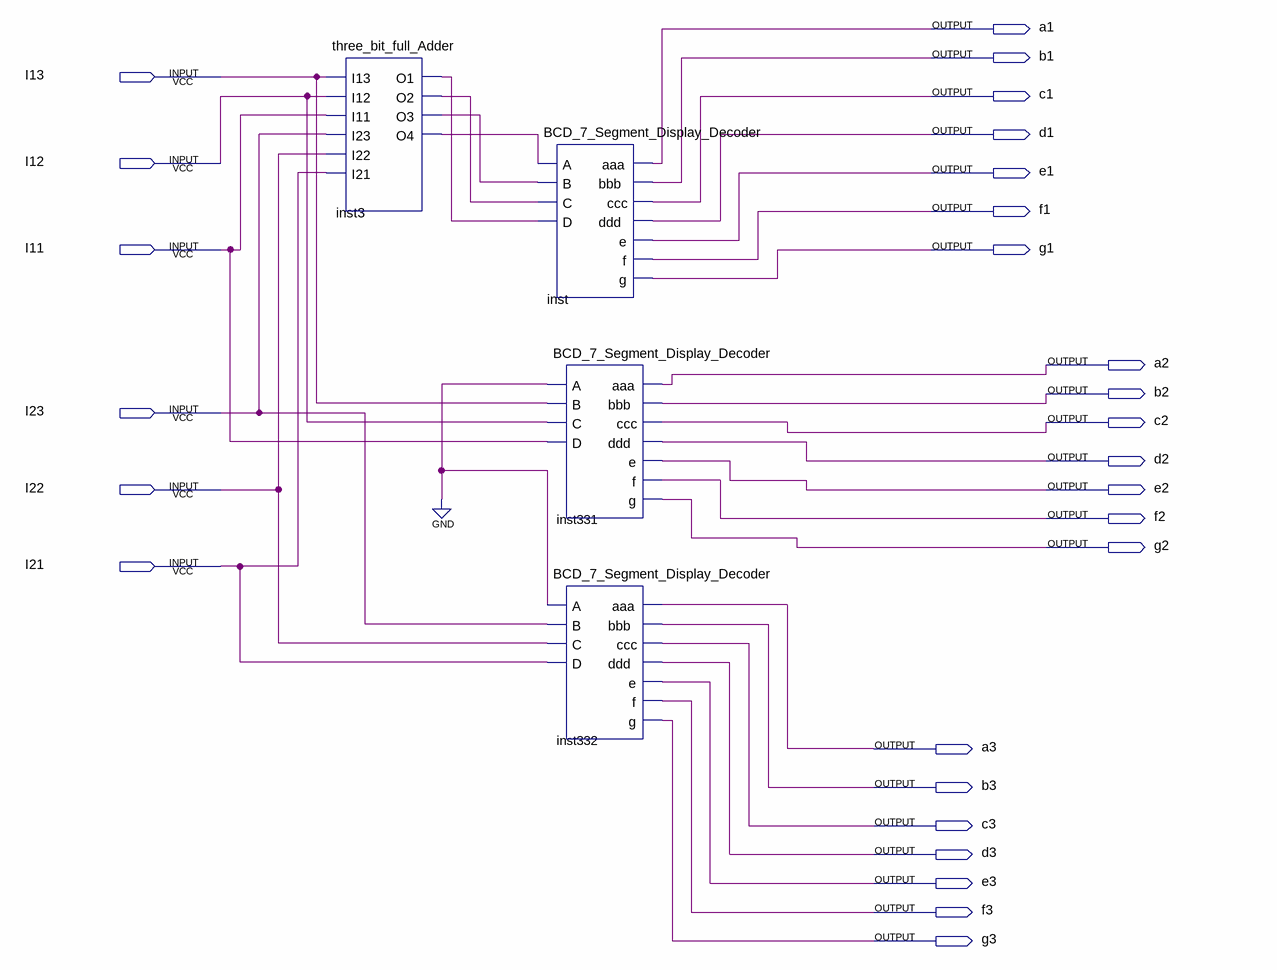
[diagram p0: schematic sheet]
// Quartus schematic two_three_bits_adder_display_decoder.bdf as structural Verilog: 4 symbols, 27 pins
module two_three_bits_adder_display_decoder (
  input  I13,
  input  I12,
  input  I11,
  input  I23,
  input  I22,
  input  I21,
  output a1,
  output b1,
  output c1,
  output d1,
  output e1,
  output f1,
  output g1,
  output a2,
  output b2,
  output c2,
  output d2,
  output e2,
  output f2,
  output g2,
  output a3,
  output b3,
  output c3,
  output d3,
  output e3,
  output f3,
  output g3
);

  wire inst3_o1, inst3_o2, inst3_o3, inst3_o4;

  three_bit_full_Adder inst3 (
    .I13(I13), .I12(I12), .I11(I11), .I23(I23), .I22(I22), .I21(I21), .O1(inst3_o1), .O2(inst3_o2),
    .O3(inst3_o3), .O4(inst3_o4));
  BCD_7_Segment_Display_Decoder inst (
    .A(inst3_o4), .B(inst3_o3), .C(inst3_o2), .D(inst3_o1), .aaa(a1), .bbb(b1), .ccc(c1), .ddd(d1), .e(e1),
    .f(f1), .g(g1));
  BCD_7_Segment_Display_Decoder inst331 (
    .A(1'b0), .B(I13), .C(I12), .D(I11), .aaa(a2), .bbb(b2), .ccc(c2), .ddd(d2), .e(e2), .f(f2), .g(g2));
  BCD_7_Segment_Display_Decoder inst332 (
    .A(1'b0), .B(I23), .C(I22), .D(I21), .aaa(a3), .bbb(b3), .ccc(c3), .ddd(d3), .e(e3), .f(f3), .g(g3));
endmodule
